# Altium schematic sheet Motor.SchDoc
size A4; SheetNumber: 4; SheetTotal: 7
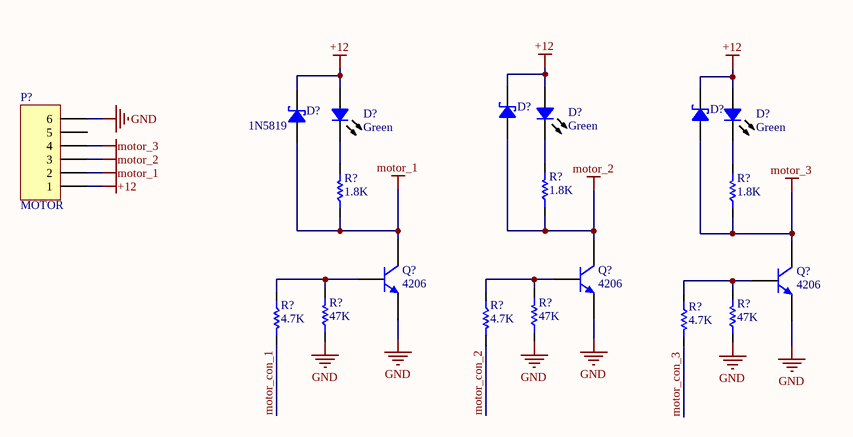
[diagram p0: Motor.SchDoc]

## Parts
(Parts that share a designator on the sheet are numbered #1, #2 ... from top to bottom, then left to right.)
D?#1  Green  [LED 0805/2012 GREEN]
D?#2  Green  [LED 0805/2012 GREEN]
D?#3  Green  [LED 0805/2012 GREEN]
D?#4  1N5819  [430X270D]
D?#5  1N5819  [430X270D]  (value not drawn)
D?#6  1N5819  [430X270D]  (value not drawn)
P?  MOTOR  [MO-Header 6]
Q?#1  Inflow: 4206  [TO-220 AB]  (hidden comment: NPN)
Q?#2  Inflow: 4206  [TO-220 AB]  (hidden comment: NPN)
Q?#3  Inflow: 4206  [TO-220 AB]  (hidden comment: NPN)
R?#1  1.8K  [RES 0805 (2012X06L)]
R?#2  1.8K  [RES 0805 (2012X06L)]
R?#3  1.8K  [RES 0805 (2012X06L)]
R?#4  4.7K  [RES 1206 (3216X08L)]
R?#5  4.7K  [RES 1206 (3216X08L)]
R?#6  4.7K  [RES 1206 (3216X08L)]
R?#7  47K  [RES 1206 (3216X08L)]
R?#8  47K  [RES 1206 (3216X08L)]
R?#9  47K  [RES 1206 (3216X08L)]

## Nets
+12: D?#1.1 D?#2.1 D?#3.1 D?#4.2 D?#5.2 D?#6.2 P?.1
GND: P?.6 Q?#1.3(E) Q?#2.3(E) Q?#3.3(E) R?#7.1 R?#8.1 R?#9.1
motor_1: D?#4.1 P?.2 Q?#1.2(C) R?#1.1
motor_2: D?#5.1 P?.3 Q?#2.2(C) R?#2.1
motor_3: D?#6.1 P?.4 Q?#3.2(C) R?#3.1
motor_con_1: R?#4.2
motor_con_2: R?#5.2
motor_con_3: R?#6.2
NetD?#1_2: D?#1.2 R?#1.2
NetD?#2_2: D?#2.2 R?#2.2
NetD?#3_2: D?#3.2 R?#3.2
NetQ?#1_1: Q?#1.1(B) R?#4.1 R?#7.2
NetQ?#2_1: Q?#2.1(B) R?#5.1 R?#8.2
NetQ?#3_1: Q?#3.1(B) R?#6.1 R?#9.2

Not connected (* = marked no-connect by the designer): P? 5

## Library data of the parts
D?#1-D?#3 = Semi_LED_SMD: LED; Inflow: inflow?; Rating: Rating?; Validation: Valid; Package: Package?; Type: LED; Value: Green
D?#4-D?#6 = Semi_Diod_Sch_1N5819_SMD: Schottky Rectifiers; Rating: Rating?; Validation: Valid; Inflow: inflow?; Package: SMA; Type: Schottky; Value: 1N5819
P? = MO-Header 6
Q?#1-Q?#3 = Semi_BJT_TIP41C: NPN Power transistor; Rating: Rating?; Type: Type?; Validation: NT; Value: NPN; Package: Package?
R?#1-R?#3 = Res_SMD_0805: Resistor; Inflow: inflow?; Rating: 0.125W; Validation: Valid; Package: 0805; Type: 10%; Value: 1.8K
R?#4-R?#9 = Res_SMD_1206: Resistor; Inflow: inflow?; Rating: 0.25W; Validation: Valid; Package: 1206; Type: 10%
  R?#4-R?#6: Value: 4.7K
  R?#7-R?#9: Value: 47K